# EAGLE design NSTAP (EAGLE 8.7.1)
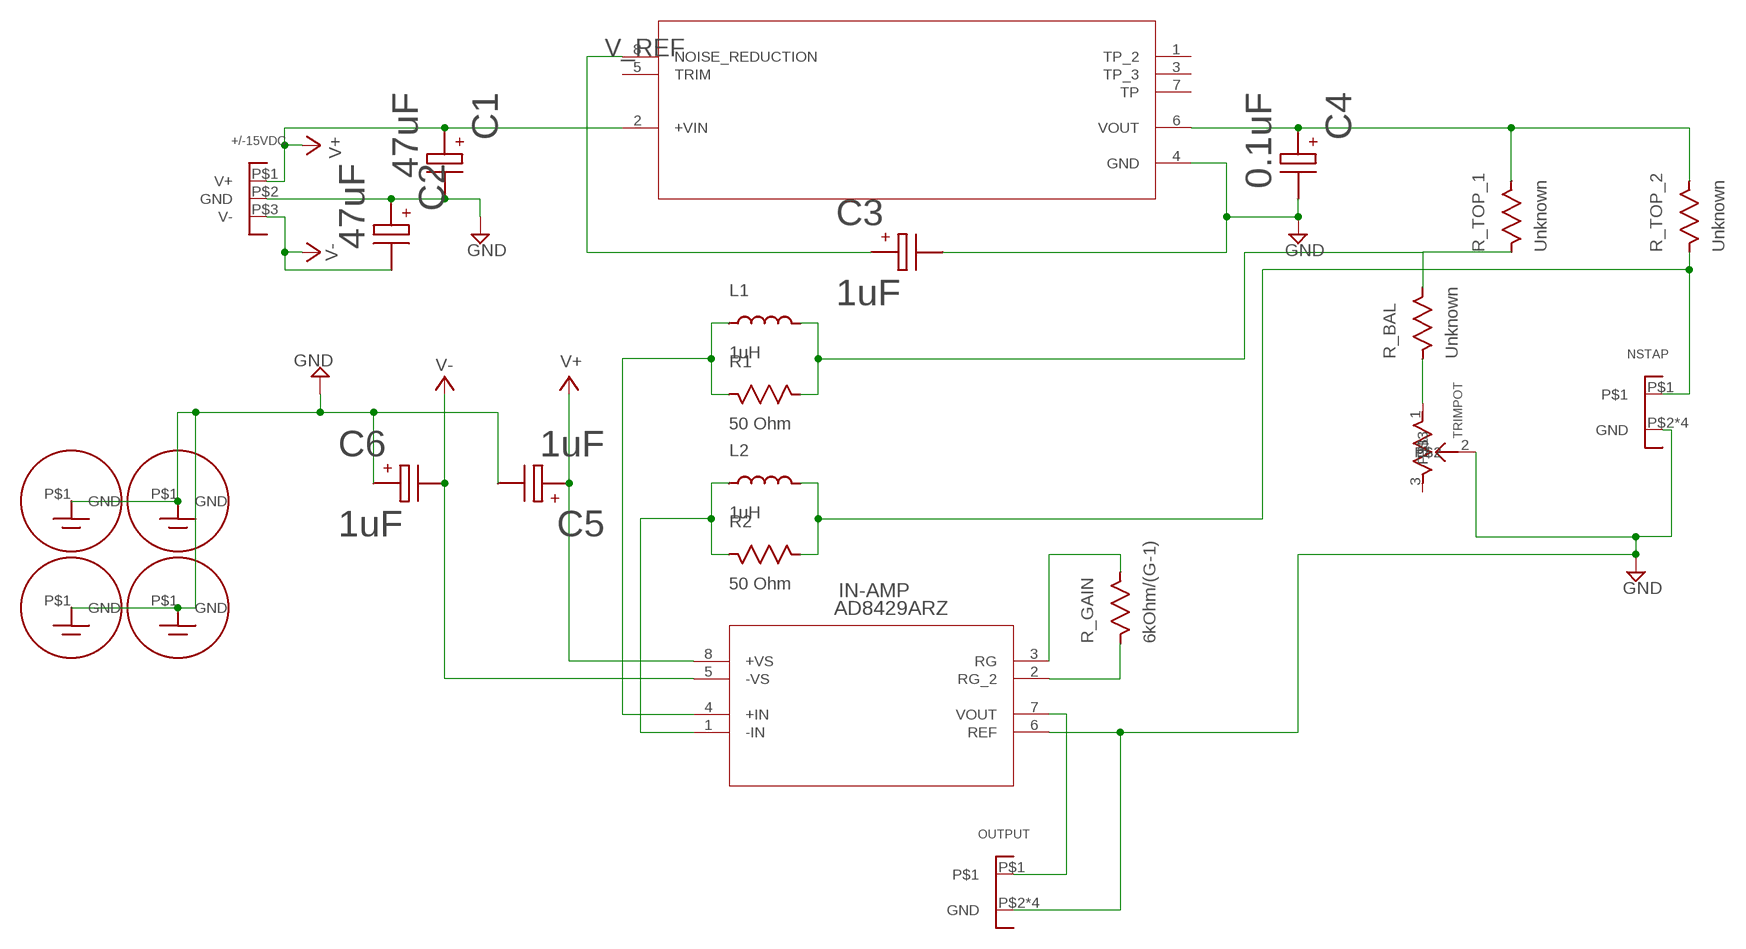
[diagram p0: schematic, sheet 1]

## Parts
+/-15VDC  CONNECTOR_3COND""  [SCREW_TERM3X-OST]
C1  47uF  CAPACITOR_POLARISEDBRD-0075X050  [BRD_0075X050-P]
C2  47uF  CAPACITOR_POLARISEDBRD-0075X050  [BRD_0075X050-P]
C3  1uF  CAPACITOR_POLARISEDBRD-0075X025  [BRD_0075X025-P]
C4  0.1uF  CAPACITOR_POLARISEDBRD-0075X050  [BRD_0075X050-P]
C5  1uF  CAPACITOR_POLARISEDBRD-0075X025  [BRD_0075X025-P]
C6  1uF  CAPACITOR_POLARISEDBRD-0075X025  [BRD_0075X025-P]
IN-AMP  AD8429ARZ  [R_8]
L1  1uH  INDUCTORBRD-0075X150  [BRD_0075X150]
L2  1uH  INDUCTORBRD-0075X150  [BRD_0075X150]
NSTAP  CONNECTOR_COAXAMPHENOL-2037  [BNC_AMPHENOL]
OUTPUT  CONNECTOR_COAXAMPHENOL-2037  [BNC_AMPHENOL]
R1  50 Ohm  RESISTORBRD-0075X100  [BRD_0075X100]
R2  50 Ohm  RESISTORBRD-0075X100  [BRD_0075X100]
R_BAL  Unknown  RESISTORBRD-0075X100  [BRD_0075X100]
R_GAIN  6kOhm/(G-1)  RESISTORBRD-0075X100  [BRD_0075X100]
R_TOP_1  Unknown  RESISTORBRD-0075X100  [BRD_0075X100]
R_TOP_2  Unknown  RESISTORBRD-0075X100  [BRD_0075X100]
TRIMPOT  TRIM_POT  [TRIM_POT]
U$1  GND-SCREW4MM  [GND-SCREW_4MM]
U$2  GND-SCREW4MM  [GND-SCREW_4MM]
U$3  GND-SCREW4MM  [GND-SCREW_4MM]
U$4  GND-SCREW4MM  [GND-SCREW_4MM]
V_REF  AD587KNZ  [N_8]

## Nets
GND: +/-15VDC.P$2(GND) C1.P$2 C2.P$1 C3.P$2 C4.P$2 C5.P$2 C6.P$1 IN-AMP.6(REF) NSTAP.P$2(GND) NSTAP.P$3(GND) NSTAP.P$4(GND) NSTAP.P$5(GND) OUTPUT.P$2(GND) OUTPUT.P$3(GND) OUTPUT.P$4(GND) OUTPUT.P$5(GND) TRIMPOT.2 U$1.P$1(GND) U$2.P$1(GND) U$3.P$1(GND) U$4.P$1(GND) V_REF.4(GND)
N$1: C3.P$1 V_REF.8(NOISE_REDUCTION)
N$2: R_BAL.P$1 TRIMPOT.1
N$3: IN-AMP.3(RG) R_GAIN.P$2
N$4: IN-AMP.2(RG_2) R_GAIN.P$1
N$5: IN-AMP.7(VOUT) OUTPUT.P$1
N$6: IN-AMP.4(+IN) L1.P$1 R1.P$1
N$8: IN-AMP.1(-IN) L2.P$1 R2.P$1
N$9: L2.P$2 NSTAP.P$1 R2.P$2 R_TOP_2.P$1
N$11: C4.P$1 R_TOP_1.P$2 R_TOP_2.P$2 V_REF.6(VOUT)
N$12: L1.P$2 R1.P$2 R_BAL.P$2 R_TOP_1.P$1
V+: +/-15VDC.P$1(V+) C1.P$1 C5.P$1 IN-AMP.8(+VS) V_REF.2(+VIN)
V-: +/-15VDC.P$3(V-) C2.P$2 C6.P$2 IN-AMP.5(-VS)
Unconnected: TRIMPOT.3 V_REF.1(TP_2) V_REF.3(TP_3) V_REF.5(TRIM) V_REF.7(TP)

## Library data of the parts
+/-15VDC = Circuit_Parts:CONNECTOR_3COND: Generic 3-conductor connector
C1-C6 = Circuit_Parts:CAPACITOR_POLARISED: Generic polarised capacitor
IN-AMP = Circuit_Parts:AD8429ARZ: G = 1+(6k/Rg) In-Amp
L1 L2 = Circuit_Parts:INDUCTOR: Generic inductor
NSTAP OUTPUT = Circuit_Parts:CONNECTOR_COAX: Generic coaxial connection
R1 R2 R_BAL R_GAIN R_TOP_1 R_TOP_2 = Circuit_Parts:RESISTOR: Generic resistor
TRIMPOT = Circuit_Parts (1):TRIM_POT
U$1-U$4 = Circuit_Parts:GND-SCREW: Screw hole with conductive pad for grounding
V_REF = Circuit_Parts:AD587KNZ: AD587 +10VDC reference 8 - PDIP; MANUFACTURER_PART_NUMBER: AD587KNZ; VENDOR: Vendor

## Board
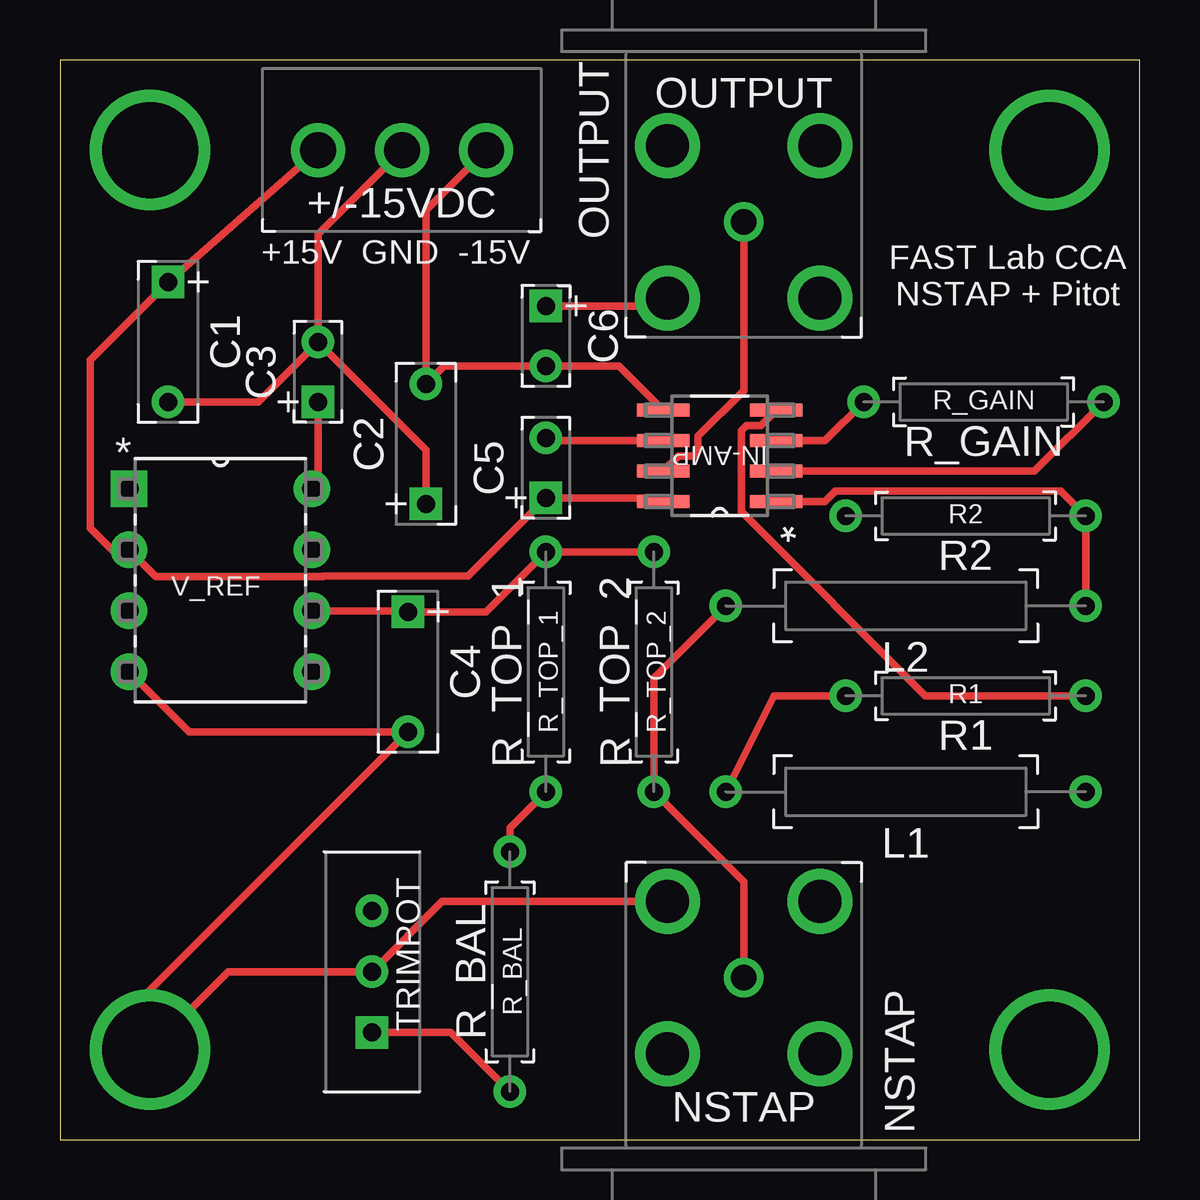
[diagram p1: board, top side]
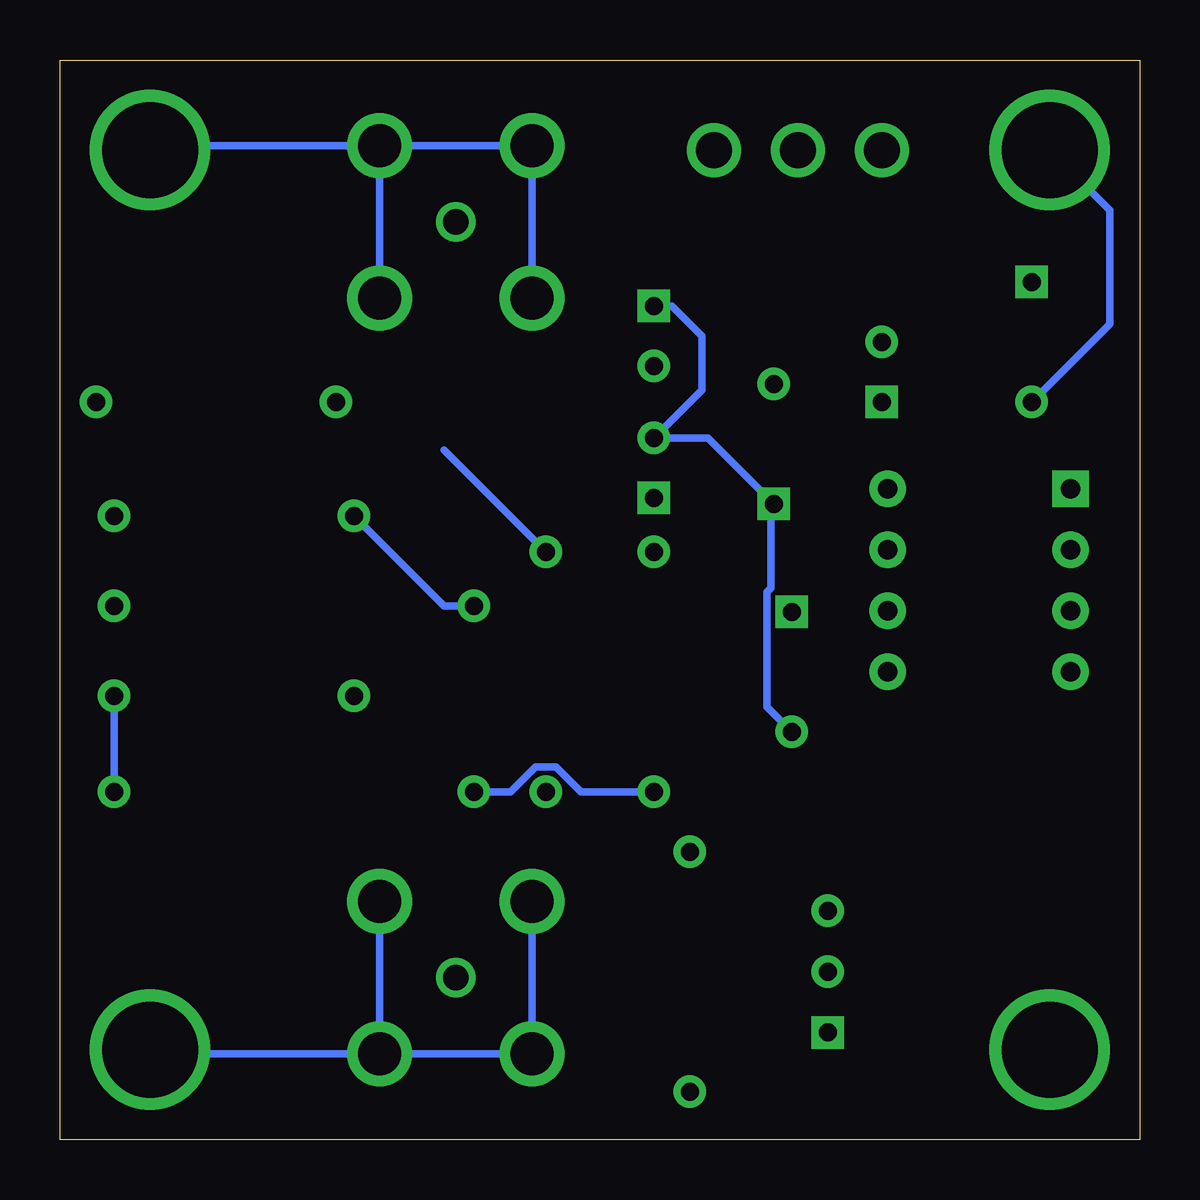
[diagram p2: board, bottom side, seen from below]

Size 45 x 45 mm. Coordinates in mm from the lower left corner, seen from the top.
Outline: 0,0 45,0 45,45 0,45 0,0
Copper layers (1*16): Top 0.035mm / dielectric 1.5mm / Bottom 0.035mm
Design rules "SparkFun": minimum track width 8mil, minimum drill 20mil, track to track 8mil, track to pad 8mil, pad to pad 8mil, via to via 8mil, smd to smd 8mil, copper to edge 8mil, drill to drill 8mil, minimum pad ring 12mil, minimum via ring 10mil, stop-mask expansion 4mil, vias tented up to drill 20mil, thermal gap 10mil

### Footprints (pad centres in the part's own frame; a part is rotated, then mirrored left to right if it is on the bottom)
SCREW_TERM3X-OST = drill 1.5: P$1 -3.5,0; P$2 0,0; P$3 3.5,0
BRD_0075X050-P = drill 0.75 square: P$1 -2.5,0 | drill 0.75: P$2 2.5,0
BRD_0075X025-P = drill 0.75 square: P$1 -1.25,0 | drill 0.75: P$2 1.25,0
R_8 = smd 2.184 x 0.559: 1 -2.362,1.905; 2 -2.362,0.635; 3 -2.362,-0.635; 4 -2.362,-1.905; 5 2.362,-1.905; 6 2.362,-0.635; 7 2.362,0.635; 8 2.362,1.905
BRD_0075X150 = drill 0.75: P$1 -7.5,0; P$2 7.5,0
BNC_AMPHENOL = drill 1.05: P$1 0,0 | drill 1.8: P$2 3.175,3.175; P$3 3.175,-3.175; P$4 -3.175,-3.175; P$5 -3.175,3.175
BRD_0075X100 = drill 0.75: P$1 -5,0; P$2 5,0
TRIM_POT = drill 0.75 square: 1 -2.54,0 | drill 0.75: 2 0,0; 3 2.54,0
GND-SCREW_4MM = drill 4: P$1 0,0
N_8 = drill 0.813 pad 1.524 square: 1 -7.62,7.62 | drill 0.813 pad 1.524: 2 -7.62,5.08; 3 -7.62,2.54; 4 -7.62,0; 5 0,0; 6 0,2.54; 7 0,5.08; 8 0,7.62

### Placement (x,y rotation side)
+/-15VDC  14.25,41.25 0 top
C1  4.5,33.25 270 top
C2  15.25,29 90 top
C3  10.75,32 90 top
C4  14.5,19.5 270 top
C5  20.25,28 90 top
C6  20.25,33.5 270 top
IN-AMP  27.5,28.5 180 top
L1  35.25,14.5 180 top
L2  35.25,22.25 180 top
NSTAP  28.5,6.75 90 top
OUTPUT  28.5,38.25 270 top
R1  37.75,18.5 180 top
R2  37.75,26 180 top
R_BAL  18.75,7 90 top
R_GAIN  38.5,30.75 180 top
R_TOP_1  20.25,19.5 90 top
R_TOP_2  24.75,19.5 90 top
TRIMPOT  13,7 90 top
U$1  41.25,41.25 270 top
U$2  3.75,41.25 0 top
U$3  41.25,3.75 0 top
U$4  3.75,3.75 0 top
V_REF  10.5,19.5 0 top

### Tracks (layer width: path | path; a pad name or v marks a point on that pad's centre or on a via)
GND
  Top 0.305: C6.P$1 25,34.75 OUTPUT.P$3 | C5.P$2 20.36,29.14 IN-AMP.6 | C1.P$2 8.25,30.75 C3.P$2 | C3.P$2 15.25,28.75 C2.P$1 | V_REF.4 5.38,17 C4.P$2 3.75,6.25 U$4.P$1 7,7 TRIMPOT.2 15.93,9.93 NSTAP.P$2 | +/-15VDC.P$2 10.75,37.75 C3.P$2
  Bottom 0.305: NSTAP.P$4 NSTAP.P$5 NSTAP.P$2 | NSTAP.P$4 NSTAP.P$3 | OUTPUT.P$3 OUTPUT.P$4 OUTPUT.P$5 | OUTPUT.P$5 OUTPUT.P$2 | C1.P$2 1.25,34 1.25,38.75 U$2.P$1 | C2.P$1 15.38,26.62 | 15.38,26.62 18,29.25 C5.P$2 18.25,31.25 18.25,33.5 19.5,34.75 C6.P$1 | 15.38,26.62 15.38,22.99 15.54,22.83 15.54,18.04 C4.P$2 | NSTAP.P$4 41.08,3.58 U$3.P$1 | OUTPUT.P$5 41.08,41.42 U$1.P$1
N$1
  Top 0.305: C3.P$1 10.75,27.37 V_REF.8
N$2
  Top 0.305: TRIMPOT.1 16.29,4.46 R_BAL.P$1
N$3
  Top 0.305: IN-AMP.3 31.89,29.14 R_GAIN.P$2
N$4
  Top 0.305: IN-AMP.2 40.62,27.86 R_GAIN.P$1
N$5
  Top 0.305: IN-AMP.7 25.77,28.5 26.38,28.5 26.59,28.71 26.59,29.31 28.5,31.23 OUTPUT.P$1
N$6
  Top 0.305: IN-AMP.4 29.23,29.77 28.62,29.77 28.41,29.56 28.41,26.17 36.08,18.5 R1.P$1
  Bottom 0.305: R1.P$1 L1.P$1
N$8
  Top 0.305: L2.P$1 R2.P$1 41.72,27.04 32.32,27.04 31.88,26.59 IN-AMP.1
N$9
  Top 0.305: L2.P$2 24.75,19.25 R_TOP_2.P$1 28.5,10.75 NSTAP.P$1
  Bottom 0.305: L2.P$2 29,22.25 R2.P$2
N$11
  Top 0.305: V_REF.6 14.46,22.04 C4.P$1 17.75,22 R_TOP_1.P$2 R_TOP_2.P$2
  Bottom 0.305: R_TOP_2.P$2 29,28.75
N$12
  Top 0.305: L1.P$2 29.75,18.5 R1.P$2 | R_BAL.P$2 18.75,13 R_TOP_1.P$1
  Bottom 0.305: R_TOP_1.P$1 23.29,14.5 24.32,15.54 25.18,15.54 26.21,14.5 L1.P$2
V+
  Top 0.305: +/-15VDC.P$1 C1.P$1 1.25,32.5 1.25,25.5 2.17,24.58 V_REF.2 4,23.46 10.96,23.46 11,23.5 17,23.5 C5.P$1 24.98,26.75 IN-AMP.8
V-
  Top 0.305: IN-AMP.5 23.29,32.25 C6.P$2 16,32.25 C2.P$2 15.25,38.75 +/-15VDC.P$3

### Text on the board
tPlace: OUTPUT | +15V GND -15V | FAST Lab CCA / NSTAP + Pitot | NSTAP